# EAGLE design expLoRaBLE Thing Plus (EAGLE 9.6.2)

## Sheet 1 of 2
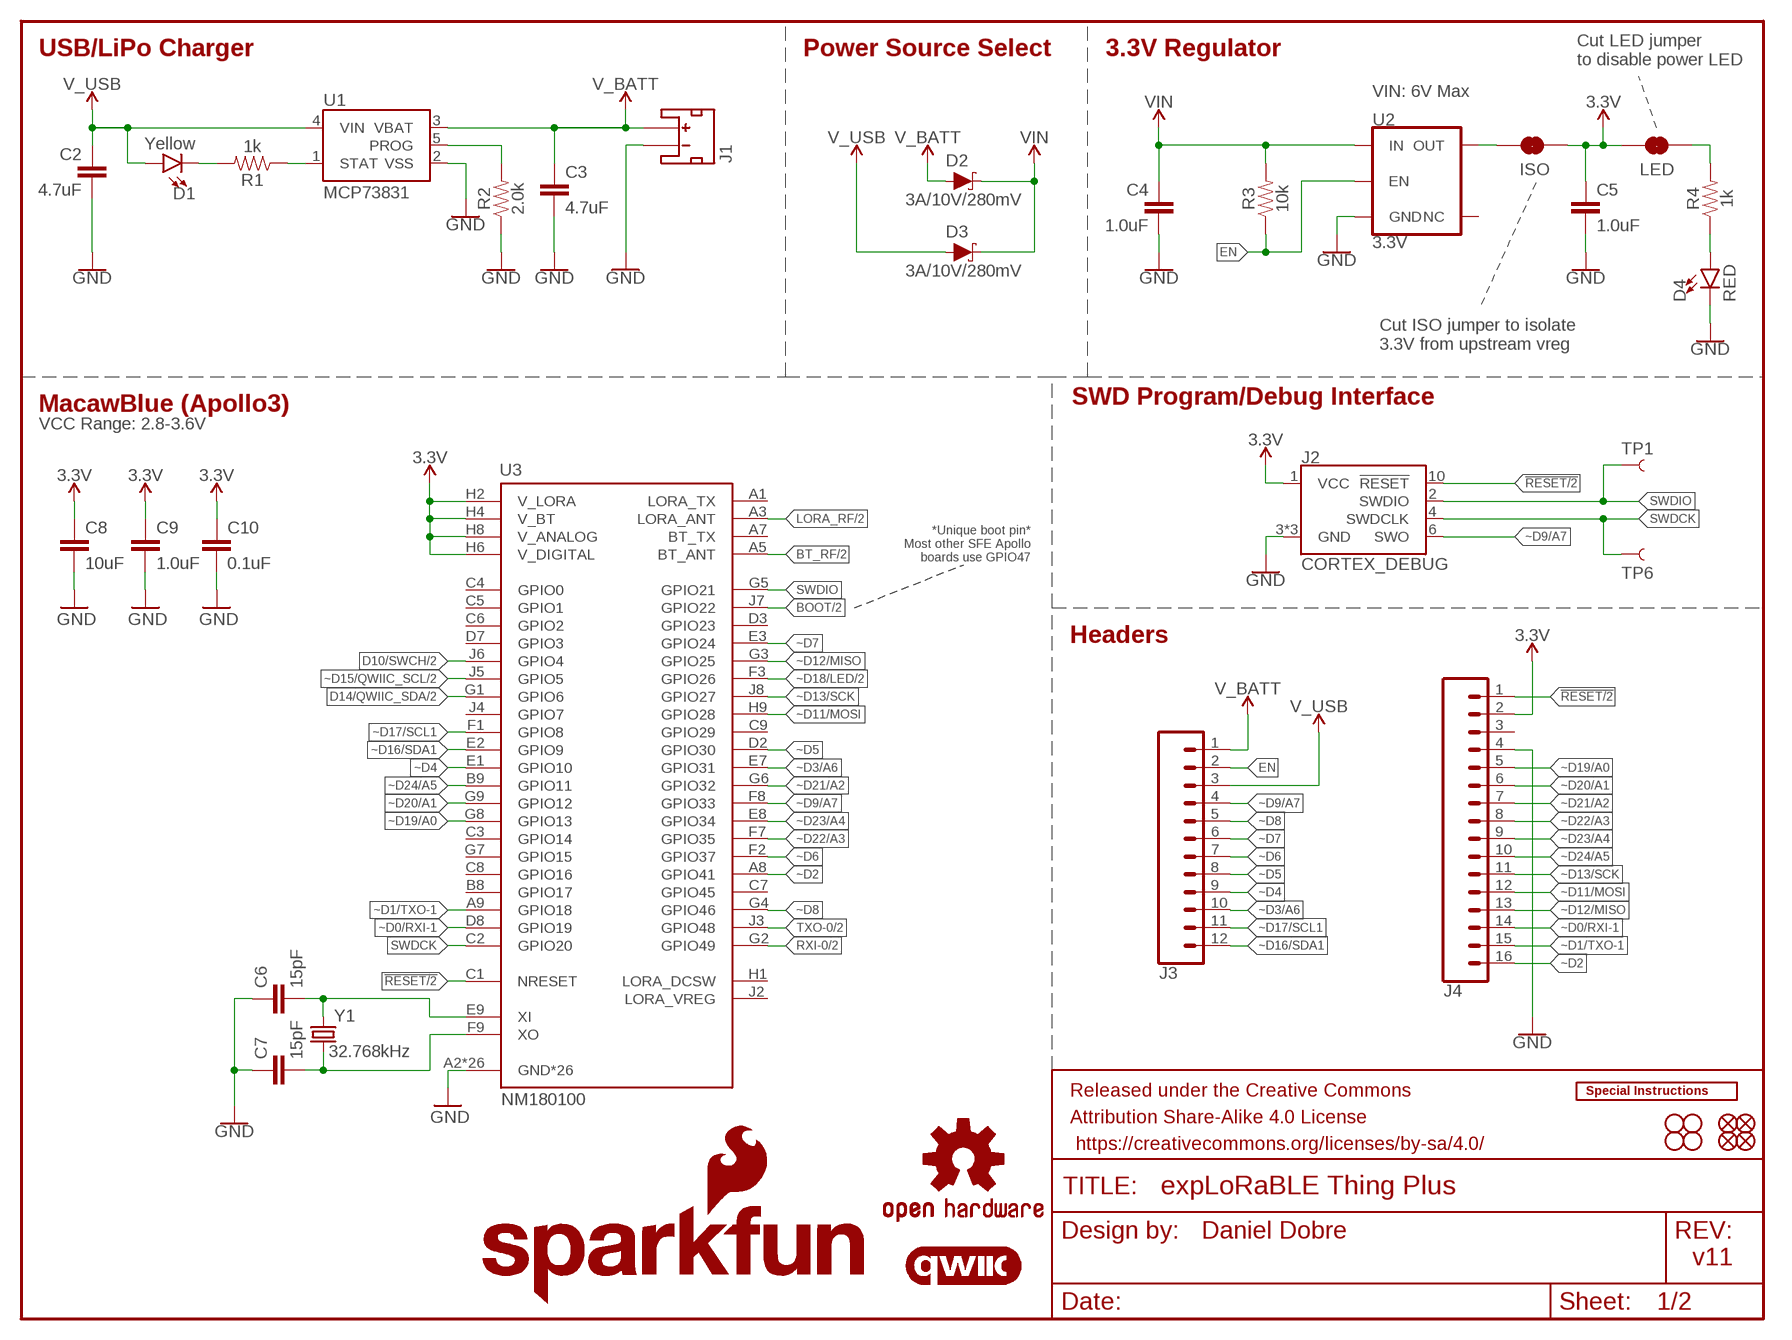
[diagram p0: schematic, sheet 1]

### Parts
C2  4.7uF  4.7UF-0603-6.3V-(10%)  [0603]
C3  4.7uF  4.7UF-0603-6.3V-(10%)  [0603]
C4  1.0uF  1.0UF-0603-16V-10%  [0603]
C5  1.0uF  1.0UF-0603-16V-10%  [0603]
C6  15pF  15PF-0603-50V-5%  [0603]
C7  15pF  15PF-0603-50V-5%  [0603]
C8  10uF  10UF-0603-6.3V-20%  [0603]
C9  1.0uF  1.0UF-0603-16V-10%  [0603]
C10  0.1uF  0.1UF-0603-25V-(+80/-20%)  [0603]
D1  Yellow  LED-YELLOW0603  [LED-0603]
D2  3A/10V/280mV  DIODE-SCHOTTKY-BAT60A  [SOD-323]
D3  3A/10V/280mV  DIODE-SCHOTTKY-BAT60A  [SOD-323]
D4  RED  LED-RED0603  [LED-0603]
FD1  FIDUCIALUFIDUCIAL  [FIDUCIAL-MICRO]
FD2  FIDUCIALUFIDUCIAL  [FIDUCIAL-MICRO]
FD3  FIDUCIALUFIDUCIAL  [FIDUCIAL-MICRO]
FD4  FIDUCIALUFIDUCIAL  [FIDUCIAL-MICRO]
FRAME1  FRAME-LETTER  [CREATIVE_COMMONS]
H1  STAND-OFF  [STAND-OFF]
H2  STAND-OFF  [STAND-OFF]
H3  STAND-OFF  [STAND-OFF]
H4  STAND-OFF  [STAND-OFF]
ISO  JUMPER-SMT_2_NC_TRACE_SILK  [SMT-JUMPER_2_NC_TRACE_SILK]
J1  JST_2MM_MALE  [JST-2-SMD]
J2  CORTEX_DEBUG  CORTEX_DEBUG_MINIMUM_PTH_NS  [2X5-PTH-1.27MM-NO_SILK]
J3  CONN_12SM_SQ_NO_SILK  [1X12_SM_SQ_NOSILK]
J4  CONN_161X16_SM_SQ_NOSILK  [1X16_SM_SQ_NOSILK]
LED  JUMPER-SMT_2_NC_TRACE_SILK  [SMT-JUMPER_2_NC_TRACE_SILK]
LOGO1  OSHW-LOGOS  [OSHW-LOGO-S]
LOGO2  QWIIC_LOGO_5MM  [QWIIC_5MM]
LOGO3  SFE_LOGO_NAME_FLAME.1_INCH  [SFE_LOGO_NAME_FLAME_.1]
LOGO4  SPECIAL_INSTRUCTIONS-ORDERING  [ORDERING_INSTRUCTIONS]
R1  1k  1KOHM-0603-1/10W-1%  [0603]
R2  2.0k  2.0KOHM-0603-1/10W-5%  [0603]
R3  10k  10KOHM-0603-1/10W-1%  [0603]
R4  1k  1KOHM-0603-1/10W-1%  [0603]
TP1  TEST-POINTTP_15TH_THRU  [TP_15TH]
TP6  TEST-POINTTP_15TH_THRU  [TP_15TH]
U1  MCP73831  [SOT23-5]
U2  3.3V  V_REG_AP2112K-3.3V  [SOT23-5]
U3  NM180100  [LGA81]
Y1  32.768kHz  CRYSTAL-32.768KHZSMD-3.2X1.5  [CRYSTAL-SMD-3.2X1.5MM]

### Nets
3.3V: C5.1 C8.1 C9.1 C10.1 ISO.1 J2.1(VCC) J4.2 LED.2 U3.H2(V_LORA) U3.H4(V_BT) U3.H6(V_DIGITAL) U3.H8(V_ANALOG) ; also sheet 2
!RESET: J2.10(!RESET) J4.1 U3.C1(NRESET) ; also sheet 2
BOOT: U3.J7(GPIO22) ; also sheet 2
BT_RF: U3.A5(BT_ANT) ; also sheet 2
D10/SWCH: U3.J6(GPIO4) ; also sheet 2
D14/QWIIC_SDA: U3.G1(GPIO6) ; also sheet 2
EN: J3.2 R3.1 U2.3(EN)
GND: C2.2 C3.2 C4.2 C5.2 C6.1 C7.1 C8.2 C9.2 C10.2 D4.C J1.1(-) J2.3(GND) J2.5(GND) J2.9(GND) J4.4 R2.1 U1.2(VSS) U2.2(GND) U3.A2(GND*26) U3.A4(GND*26) U3.A6(GND*26) U3.B1(GND*26) U3.B2(GND*26) U3.B3(GND*26) U3.B4(GND*26) U3.B5(GND*26) U3.B6(GND*26) U3.B7(GND*26) U3.D1(GND*26) U3.D4(GND*26) U3.D5(GND*26) U3.D6(GND*26) U3.D9(GND*26) U3.E4(GND*26) U3.E5(GND*26) U3.E6(GND*26) U3.F4(GND*26) U3.F5(GND*26) U3.F6(GND*26) U3.H3(GND*26) U3.H5(GND*26) U3.H7(GND*26) U3.J1(GND*26) U3.J9(GND*26) ; also sheet 2
LORA_RF: U3.A3(LORA_ANT) ; also sheet 2
N$1: R2.2 U1.5(PROG)
N$2: C7.2 U3.F9(XO) Y1.P$2
N$3: D1.C R1.2
N$4: R1.1 U1.1(STAT)
N$6: LED.1 R4.2
N$8: C6.2 U3.E9(XI) Y1.P$1
N$10: D4.A R4.1
N$14: ISO.2 U2.5(OUT)
RXI-0: U3.G2(GPIO49) ; also sheet 2
SWDCK: J2.4(SWDCLK) TP6.P$1 U3.C2(GPIO20)
SWDIO: J2.2(SWDIO) TP1.P$1 U3.G5(GPIO21)
TXO-0: U3.J3(GPIO48) ; also sheet 2
V_BATT [power]: C3.1 D2.A J1.2(+) J3.1 U1.3(VBAT)
V_USB: C2.1 D1.A D3.A J3.3 U1.4(VIN) ; also sheet 2
VIN: C4.1 D2.C D3.C R3.2 U2.1(IN)
~D0/RXI-1: J4.14 U3.D8(GPIO19)
~D1/TXO-1: J4.15 U3.A9(GPIO18)
~D2: J4.16 U3.A8(GPIO41)
~D3/A6: J3.10 U3.E7(GPIO31)
~D4: J3.9 U3.E1(GPIO10)
~D5: J3.8 U3.D2(GPIO30)
~D6: J3.7 U3.F2(GPIO37)
~D7: J3.6 U3.E3(GPIO24)
~D8: J3.5 U3.G4(GPIO46)
~D9/A7: J2.6(SWO) J3.4 U3.F8(GPIO33)
~D11/MOSI: J4.12 U3.H9(GPIO28)
~D12/MISO: J4.13 U3.G3(GPIO25)
~D13/SCK: J4.11 U3.J8(GPIO27)
~D15/QWIIC_SCL: U3.J5(GPIO5) ; also sheet 2
~D16/SDA1: J3.12 U3.E2(GPIO9)
~D17/SCL1: J3.11 U3.F1(GPIO8)
~D18/LED: U3.F3(GPIO26) ; also sheet 2
~D19/A0: J4.5 U3.G8(GPIO13)
~D20/A1: J4.6 U3.G9(GPIO12)
~D21/A2: J4.7 U3.G6(GPIO32)
~D22/A3: J4.8 U3.F7(GPIO35)
~D23/A4: J4.9 U3.E8(GPIO34)
~D24/A5: J4.10 U3.B9(GPIO11)
Unconnected: J1.NC1(PAD1) J1.NC2(PAD2) J4.3 U2.4(NC) U3.A1(LORA_TX) U3.A7(BT_TX) U3.B8(GPIO17) U3.C3(GPIO14) U3.C4(GPIO0) U3.C5(GPIO1) U3.C6(GPIO2) U3.C7(GPIO45) U3.C8(GPIO16) U3.C9(GPIO29) U3.D3(GPIO23) U3.D7(GPIO3) U3.G7(GPIO15) U3.H1(LORA_DCSW) U3.J2(LORA_VREG) U3.J4(GPIO7)

### Notes on the sheet
- USB/LiPo Charger | Power Source Select | 3.3V Regulator
- Cut LED jumper
  to disable power LED
- VIN: 6V Max
- Cut ISO jumper to isolate 
  3.3V from upstream vreg
- SWD Program/Debug Interface
- MacawBlue (Apollo3)
- VCC Range: 2.8-3.6V
- *Unique boot pin*
  Most other SFE Apollo
  boards use GPIO47
- Headers
- Daniel Dobre
- v11

## Sheet 2 of 2
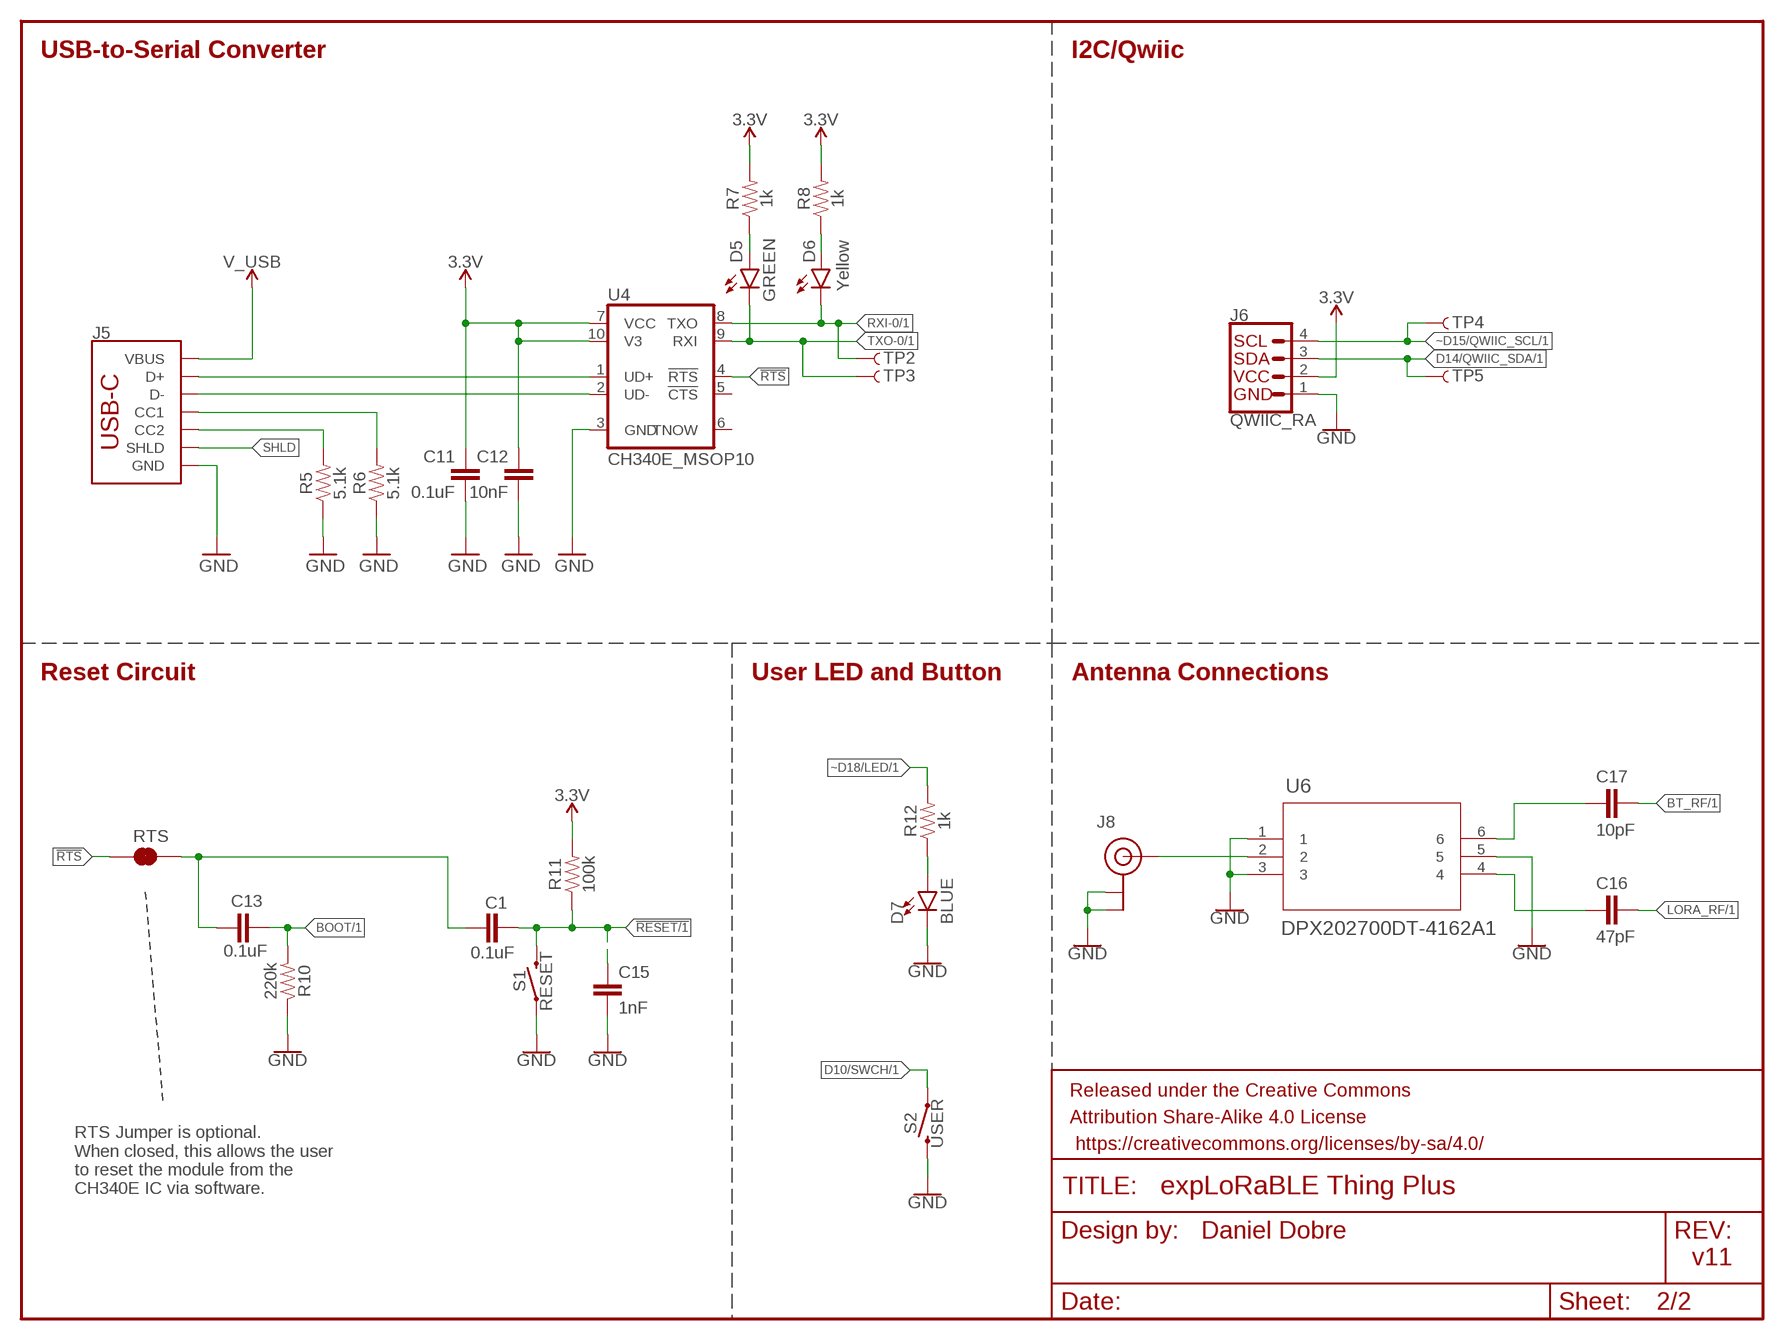
[diagram p1: schematic, sheet 2]

### Parts
C1  0.1uF  0.1UF-0603-25V-(+80/-20%)  [0603]
C11  0.1uF  0.1UF-0603-25V-(+80/-20%)  [0603]
C12  10nF  10NF-0603-50V-10%  [0603]
C13  0.1uF  0.1UF-0603-25V-(+80/-20%)  [0603]
C15  1nF  1.0NF/1000PF-0603-50V-10%  [0603]
C16  47pF  47PF-0603-50V-5%  [0603]
C17  10pF  10PF-0603-50V-5%  [0603]
D5  GREEN  LED-GREEN0603  [LED-0603]
D6  Yellow  LED-YELLOW0603  [LED-0603]
D7  BLUE  LED-BLUE0603  [LED-0603]
FRAME2  FRAME-LETTERNO_PACKAGE  [DUMMY]
J5  USB Female Type C Connector  USB_C_4-LAYER-ISOLATED  [USB-C-16P-4LAYER-ISOLATED]
J6  QWIIC_RA  QWIIC_CONNECTORJS-1MM  [JST04_1MM_RA]
J8  U.FL  [U.FL]
R5  5.1k  5.1KOHM5.1KOHM-0603-1/10W-1%  [0603]
R6  5.1k  5.1KOHM5.1KOHM-0603-1/10W-1%  [0603]
R7  1k  1KOHM-0603-1/10W-1%  [0603]
R8  1k  1KOHM-0603-1/10W-1%  [0603]
R10  220k  220KOHM-0603-1/10W-1%  [0603]
R11  100k  100KOHM-0603-1/10W-1%  [0603]
R12  1k  1KOHM-0603-1/10W-1%  [0603]
RTS  JUMPER-SMT_2_NC_TRACE_SILK  [SMT-JUMPER_2_NC_TRACE_SILK]
S1  RESET  MOMENTARY-SWITCH-SPST-SMD-4.6X2.8MM  [TACTILE_SWITCH_SMD_4.6X2.8MM]
S2  USER  MOMENTARY-SWITCH-SPST-SMD-4.6X2.8MM  [TACTILE_SWITCH_SMD_4.6X2.8MM]
TP2  TEST-POINTTP_15TH_THRU  [TP_15TH]
TP3  TEST-POINTTP_15TH_THRU  [TP_15TH]
TP4  TEST-POINTTP_15TH_THRU  [TP_15TH]
TP5  TEST-POINTTP_15TH_THRU  [TP_15TH]
U4  CH340E_MSOP10  [MSOP10]
U6  DPX202700DT-4162A1  [RF_4060A1_TDK]

### Nets
3.3V: C11.1 C12.1 J6.2 R7.2 R8.2 R11.2 U4.7(VCC) U4.10(V3) ; also sheet 1
!RESET: C1.2 C15.1 R11.1 S1.3 S1.4 ; also sheet 1
!RTS: RTS.1 U4.4(!RTS)
BOOT: C13.2 R10.2 ; also sheet 1
BT_RF: C17.1 ; also sheet 1
CC1: J5.A5(CC1) R6.2
CC2: J5.B5(CC2) R5.2
D10/SWCH: S2.1 S2.2 ; also sheet 1
D14/QWIIC_SDA: J6.3 TP5.P$1 ; also sheet 1
D+1: J5.A6(D+) J5.B6(D+) U4.1(UD+)
D-1: J5.A7(D-) J5.B7(D-) U4.2(UD-)
GND: C11.2 C12.2 C15.2 D7.C J5.GND J5.GND2(GND) J6.1 J8.1(GND) J8.2(GND) R5.1 R6.1 R10.1 S1.1 S1.2 S2.3 S2.4 U4.3(GND) U6.1 U6.3 U6.5 ; also sheet 1
LORA_RF: C16.1 ; also sheet 1
N$5: D5.A R7.1
N$7: D7.A R12.1
N$9: D6.A R8.1
N$11: C17.2 U6.6
N$12: J8.FEED(SIGNAL) U6.2
N$13: C16.2 U6.4
N$15: C1.1 C13.1 RTS.2
RXI-0: D6.C TP2.P$1 U4.8(TXO) ; also sheet 1
SHLD: J5.SHLD1(SHLD) J5.SHLD2(SHLD) J5.SHLD3(SHLD) J5.SHLD4(SHLD) J5.SHLD5(SHLD) J5.SHLD6(SHLD) J5.SHLD7(SHLD) J5.SHLD8(SHLD)
TXO-0: D5.C TP3.P$1 U4.9(RXI) ; also sheet 1
V_USB: J5.VBUS1(VBUS) J5.VBUS2(VBUS) ; also sheet 1
~D15/QWIIC_SCL: J6.4 TP4.P$1 ; also sheet 1
~D18/LED: R12.2 ; also sheet 1
Unconnected: U4.5(!CTS) U4.6(TNOW)

### Notes on the sheet
- USB-to-Serial Converter | I2C/Qwiic
- Reset Circuit | User LED and Button | Antenna Connections
- RTS Jumper is optional.
  When closed, this allows the user 
  to reset the module from the 
  CH340E IC via software.
- Daniel Dobre
- v11

## Library data of the parts
C1 C10 C11 C13 = SparkFun-Capacitors:0.1UF: 0.1µF ceramic capacitors A capacitor is a passive two-terminal electrical component used to store electrical energy temporarily in an electric field.; PROD_ID: CAP-00810
C2 C3 = SparkFun-Capacitors:4.7UF: 4.7µF ceramic capacitors A capacitor is a passive two-terminal electrical component used to store electrical energy temporarily in an electric field.; PROD_ID: CAP-08280
C4 C5 C9 = SparkFun-Capacitors:1.0UF: 1µF ceramic capacitors A capacitor is a passive two-terminal electrical component used to store electrical energy temporarily in an electric field.; PROD_ID: CAP-00868
C6 C7 = SparkFun-Capacitors:15PF: 15pF ceramic capacitors A capacitor is a passive two-terminal electrical component used to store electrical energy temporarily in an electric field.; PROD_ID: CAP-07881
C8 = SparkFun-Capacitors:10UF: 10.0µF ceramic capacitors A capacitor is a passive two-terminal electrical component used to store electrical energy temporarily in an electric field.; PROD_ID: CAP-11015
C12 = SparkFun-Capacitors:10NF: 0.01uF/10nF/10,000pF ceramic capacitors A capacitor is a passive two-terminal electrical component used to store electrical energy temporarily in an electric field. CAP-09321; PROD_ID: CAP-00867
C15 = SparkFun-Capacitors:1.0NF/1000PF: 1nF/1,000pF ceramic capacitors A capacitor is a passive two-terminal electrical component used to store electrical energy temporarily in an electric field.; PROD_ID: CAP-07886
C16 = SparkFun-Capacitors:47PF: 47pF ceramic capacitors A capacitor is a passive two-terminal electrical component used to store electrical energy temporarily in an electric field.; PROD_ID: CAP-08913
C17 = SparkFun-Capacitors:10PF: 10pF ceramic capacitors A capacitor is a passive two-terminal electrical component used to store electrical energy temporarily in an electric field.; PROD_ID: CAP-11812
D1 D6 = SparkFun-LED:LED-YELLOW: Yellow SMD LED Used in manufacturing several products at SparkFun. Packages: 0603 - SMD 0603 package[Product Link] <http://www.kingbrightusa.com/product.asp?catalog_name=LED&product_id=APT1608SYCK> 0603 -SMART - SMART SMD 0603 package (more efficient/more expensive) [Product Link] <http://www.osram-os.com/osram_os/en/products/product-catalog/led-light-emitting-diodes/smartled-0603/ly-l29k/index.jsp> LilyPad - SMD1206 package[Product Datasheet] <https://www.sparkfun.com/datasheets/DevTools/LilyPad/Q150YUS4.pdf> SparkFun Products: Blynk Board <https://www.sparkfun.com/products/13794> IOIO-OTG <https://www.sparkfun.com/products/13613> XBee Explorer Serial <https://www.sparkfun.com/products/13225>; PROD_ID: DIO-09003
D2 D3 = SparkFun-DiscreteSemi:DIODE-SCHOTTKY: Schottky diode A Schottky diode is a semiconductor diode which has a low forward voltage drop and a very fast switching action.; PROD_ID: DIO-14072
D4 = SparkFun-LED:LED-RED: Red SMD LED Used in manufacturing of most products at SparkFun Packages: 0603 - SMD 0603 package [Product Link] <http://docs.avagotech.com/docs/AV02-0551EN> 0603 SMART - SMD 0603 SMART package ( more efficient and expensive)[Product Link] <http://www.osram-os.com/Graphics/XPic2/00077099_0.pdf> 1206 - SMD1206 package [Product Link] <https://www.sparkfun.com/datasheets/DevTools/LilyPad/Q150OVS4.pdff> SparkFun Products: Pro Mini 328 -5V <https://www.sparkfun.com/products/821> RedBoard <https://www.sparkfun.com/products/12757> IOIO-OTG <https://www.sparkfun.com/products/13613>; PROD_ID: DIO-00819
D5 = SparkFun-LED:LED-GREEN: Green SMD LED Used in manufacturing of various products at SparkFun Packages: 0603 - SMD 0603 package [Product Link] <http://www.futureelectronics.com/en/technologies/semiconductors/optoelectronics/leds/Pages/9894312-LTST-C190GKT.aspx?CrossPart=HSMG-C190&IM=0> LilyPad 1206 - SMD1206 LilyPad package [Product Link] <http://www.futureelectronics.com/en/Technologies/Product.aspx?ProductID=IN150NGHARVATEKCORPORATION2049943&IM=0> 1206 - SMD1206 package [Product Link] <http://www.futureelectronics.com/en/technologies/semiconductors/optoelectronics/leds/Pages/8315665-LTST-C150KGKT.aspx?IM=0> 1206 Bottom Mount -SMD 1206 Bottom Mount [Product Link] <http://www.digikey.com/product-detail/en/lite-on-inc/LTST-C230KGKT/160-1456-1-ND/386854> SparkFun Products: Pro Mini 328 -5V <https://www.sparkfun.com/products/821> RedBoard <https://www.sparkfun.com/products/12757> MP3 Trigger <https://www.sparkfun.com/products/13720> Makey Makey <https://www.sparkfun.com/products/11076>; PROD_ID: DIO-00821
D7 = SparkFun-LED:LED-BLUE: Blue SMD LED Used in manufacturing of various products at SparkFun Packages: 0603 - SMD 0603 package [Product Link] <http://www.digikey.com/product-detail/en/SMLE12BC7TT86/511-1589-2-ND/1641808> 1206 - SMD1206 package [Product Link] <http://www.digikey.com/product-detail/en/lite-on-inc/LTST-C150TBKT/160-1643-1-ND/573584> SparkFun Products: ESP8266 Thing-Dev Board <https://www.sparkfun.com/products/13711> RedBoard <https://www.sparkfun.com/products/12757>; PROD_ID: DIO-08575
FD1-FD4 = SparkFun-Aesthetics:FIDUCIAL: Fiducial Alignment Points Point-of-reference for pick-and-place machines and other optical instruments.
FRAME1 = SparkFun-Aesthetics:FRAME-LETTER: Schematic Frame - Letter Standard 8.5x11 US Letter frame
FRAME2 = SparkFun-Aesthetics:FRAME-LETTER: Schematic Frame - Letter Standard 8.5x11 US Letter frame; DESIGNER: Nobody; VERSION: v01
H1-H4 = SparkFun-Hardware:STAND-OFF: Stand Off Drill holes for mechanically mounting via screws, standoffs, etc. Note: Use the keepout ring to avoid running the screw head into surrounding components. Variant Overviews STAND-OFF - Mechanical footprint for a #4 phillips button head screw. STAND-OFF-TIGHT - Mechanical footprint for a #4 phillips button head screw, Example SparkFun Products Screw - Phillips Head (1/4", 4-40, 10 pack) <https://www.sparkfun.com/products/10453> (PRT-10453) Screw - Phillips Head (1/2", 4-40, 10 pack) <https://www.sparkfun.com/products/10452> (PRT-10452) Screw - Phillips Head (3/4", 4-40, 10 pack) <https://www.sparkfun.com/products/10451> (PRT-10451) Screw - Phillips Head (1", 4-40, 10 pack) <https://www.sparkfun.com/products/10450> (PRT-10450)
ISO LED RTS = SparkFun-Jumpers:JUMPER-SMT_2_NC_TRACE: Normally closed trace jumper This jumper has a trace between two pads so it's normally closed (NC). Use a razor knife to open the connection. For best results follow the IPC guidelines for cutting traces: Cutout at least 0.063 mm (0.005 in). Remove all loose material to clean up the cut area. Seal the cut with an approved epoxy. Reapply solder to reclose the connection.
J1 = SparkFun-Connectors:JST_2MM_MALE: JST 2MM MALE RA CONNECTOR Two pin, compact surface mount connector. Commonly used as a battery input connection point. We really like the solid locking feeling and high current rating on these small connectors. We use these all the time as battery connectors. Mates to single-cell LiPo batteries. Here is the connector we sell at SparkFun: JST Right Angle Connector - White <https://www.sparkfun.com/products/8612> (PRT-08612) Datasheet <http://www.sparkfun.com/datasheets/Prototyping/Connectors/JST-Horizontal.pdf> It was used on these SparkFun products: SparkFun MOSFET Power Controller <https://www.sparkfun.com/products/11214> (PRT-11214) SparkFun Battery Babysitter - LiPo Battery Manager <https://www.sparkfun.com/products/13777> (PRT-13777) And many, many others that required a lipo battery connection.; PROD_ID: CONN-11443; SF_ID: PRT-08612
J2 = SparkFun-Connectors:CORTEX_DEBUG_MINIMUM: Cortex Debug Connector - 10 pin Supports JTAG debug, Serial Wire debug, and Serial Wire Viewer. PTH and SMD connector options available. General Connector Information <http://infocenter.arm.com/help/topic/com.arm.doc.faqs/attached/13634/cortex_debug_connectors.pdf> Products: PTH Connector <http://www.digikey.com/product-detail/en/cnc-tech/3220-10-0100-00/1175-1627-ND/3883661> -via Digi-Key SparkFun PSoc <https://www.sparkfun.com/products/13229> SparkFun T <https://www.sparkfun.com/products/13810>
J3 = SparkFun-Connectors:CONN_12: Multi connection point. Often used as Generic Header-pin footprint for 0.1 inch spaced/style header connections On any of the 0.1 inch spaced packages, you can populate with these: Break Away Headers - Straight <https://www.sparkfun.com/products/116> (PRT-00116) Break Away Male Headers - Right Angle <https://www.sparkfun.com/products/553> (PRT-00553) Female Headers <https://www.sparkfun.com/products/115> (PRT-00115) Break Away Headers - Machine Pin <https://www.sparkfun.com/products/117> (PRT-00117) Break Away Female Headers - Swiss Machine Pin <https://www.sparkfun.com/products/743> (PRT-00743) For SCREWTERMINALS and SPRING TERMINALS visit here: Screw Terimnals on SparkFun.com <https://www.sparkfun.com/search/results?term=Screw+Terminals> (5mm/3.5mm/2.54mm spacing) This device is also useful as a general connection point to wire up your design to another part of your project. Our various solder wires solder well into these plated through hole pads. Hook-Up Wire - Assortment (Stranded, 22 AWG) <https://www.sparkfun.com/products/11375> (PRT-11375) Hook-Up Wire - Assortment (Solid Core, 22 AWG) <https://www.sparkfun.com/products/11367> (PRT-11367) View the entire wire category on our website here <https://www.sparkfun.com/categories/141> Special notes: Molex polarized connector foot print use with SKU : PRT-08231 with associated crimp pins and housings. 1MM SMD Version SKU: PRT-10208 NOTES ON THE VARIANTS LOCK and LOCK_LONGPADS... This footprint was designed to help hold the alignment of a through-hole component (i.e. 6-pin header) while soldering it into place. You may notice that each hole has been shifted either up or down by 0.005 of an inch from it's more standard position (which is a perfectly straight line). This slight alteration caused the pins (the squares in the middle) to touch the edges of the holes. Because they are alternating, it causes a "brace" to hold the component in place. 0.005 has proven to be the perfect amount of "off-center" position when using our standard breakaway headers. Although looks a little odd when you look at the bare footprint, once you have a header in there, the alteration is very hard to notice. Also,if you push a header all the way into place, it is covered up entirely on the bottom side.
J4 = SparkFun-Connectors:CONN_16: Multi connection point. Often used as Generic Header-pin footprint for 0.1 inch spaced/style header connections On any of the 0.1 inch spaced packages, you can populate with these: Break Away Headers - Straight <https://www.sparkfun.com/products/116> (PRT-00116) Break Away Male Headers - Right Angle <https://www.sparkfun.com/products/553> (PRT-00553) Female Headers <https://www.sparkfun.com/products/115> (PRT-00115) Break Away Headers - Machine Pin <https://www.sparkfun.com/products/117> (PRT-00117) Break Away Female Headers - Swiss Machine Pin <https://www.sparkfun.com/products/743> (PRT-00743) For SCREWTERMINALS and SPRING TERMINALS visit here: Screw Terimnals on SparkFun.com <https://www.sparkfun.com/search/results?term=Screw+Terminals> (5mm/3.5mm/2.54mm spacing) This device is also useful as a general connection point to wire up your design to another part of your project. Our various solder wires solder well into these plated through hole pads. Hook-Up Wire - Assortment (Stranded, 22 AWG) <https://www.sparkfun.com/products/11375> (PRT-11375) Hook-Up Wire - Assortment (Solid Core, 22 AWG) <https://www.sparkfun.com/products/11367> (PRT-11367) View the entire wire category on our website here <https://www.sparkfun.com/categories/141> Special notes: Molex polarized connector foot print use with SKU : PRT-08231 with associated crimp pins and housings. 1MM SMD Version SKU: PRT-10208 NOTES ON THE VARIANTS LOCK and LOCK_LONGPADS... This footprint was designed to help hold the alignment of a through-hole component (i.e. 6-pin header) while soldering it into place. You may notice that each hole has been shifted either up or down by 0.005 of an inch from it's more standard position (which is a perfectly straight line). This slight alteration caused the pins (the squares in the middle) to touch the edges of the holes. Because they are alternating, it causes a "brace" to hold the component in place. 0.005 has proven to be the perfect amount of "off-center" position when using our standard breakaway headers. Although looks a little odd when you look at the bare footprint, once you have a header in there, the alteration is very hard to notice. Also,if you push a header all the way into place, it is covered up entirely on the bottom side.
J5 = SparkFun-Connectors:USB_C: USB Type C 16Pin Connector Super Speed pins not available on the 16-pin purely SMD connector so this part is best for USB 2.0 implementations. D1 and D2 are tied together enabling D+/- no matter which way the cable is plugged into the connector. The two channel configuration pins (CC1/2) are exposed. These are normally connected to ground via 5.1k resistors but can be reconfigured for high current/high power applications. **4-LAYER BOARD WARNING!!** If designing 4-layer board, make sure to select the variant _4-LAYER-ISOLATED. The linked footprint (USB-C-16-4LAYER-ISOLATED) includes some very necessary cutout polygons in the inner layers (2 and 15). This prevents the PTH mounting shield legs on the USB connector from electrically connecting any other polygons on the inner layers (usually VCC and GND).; PROD_ID: CONN-14122
J6 = SparkFun-Connectors:QWIIC_CONNECTOR: SparkFun I2C Standard Qwiic Connector An SMD 1mm pitch JST connector makes it easy and quick (get it? Qwiic?) to connect I2C devices to each other. The Qwiic system <http://www.sparkfun.com/qwiic> enables fast and solderless connection between popular platforms and various sensors and actuators. We carry 200mm <https://www.sparkfun.com/products/14204>, 100mm <https://www.sparkfun.com/products/14205>, 50mm <https://www.sparkfun.com/products/14206>, and breadboard friendly <https://www.sparkfun.com/products/14207> Qwiic cables. We also offer 10 pcs strips <https://www.sparkfun.com/products/14323> the SMD connectors.; PROD_ID: CONN-13694; VALUE: QWIIC_RIGHT_ANGLE
J8 = SparkFun-Connectors:U.FL: SMD Antenna Connector - U.FL 2mm height, 3.0mm x 3.0mm receptacle size. SparkFun Products: SparkFun WiFi Shield - ESP8266 <https://www.sparkfun.com/products/13287> SparkFun ESP8266 Thing <https://www.sparkfun.com/products/13231> SparkFun MiniGen - Pro Mini Signal Generator Shield <https://www.sparkfun.com/products/11420>; PROD_ID: CONN-09193; SF_ID: WRL-09144
LOGO1 = SparkFun-Aesthetics:OSHW-LOGO: Open-Source Hardware (OSHW) Logo This logo indicates the piece of hardware it is found on incorporates a OSHW license and/or adheres to the definition of open source hardware found here: http://freedomdefined.org/OSHW
LOGO2 = SparkFun-Aesthetics:QWIIC_LOGO: Qwiic Logos for placement on schematic and PCB. The 5.5mm silk logo is best for placing next to Qwiic connector.
LOGO3 = SparkFun-Aesthetics:SFE_LOGO_NAME_FLAME: SparkFun Font Logo w/ Flame This is the SparkFun full logo. The logo on the schematic will always be the same size; the package variant is the height of the flame part of the logo. Default layer for the logo on the board is tSilk.
LOGO4 = SparkFun-Aesthetics:SPECIAL_INSTRUCTIONS: Special Ordering/Production Instructions Alert Symbol for special PCB ordering instructions or unique production process warnings. Ordering Instructions Production Instructions Types of information that should be added to box: Copper weight Soldermask color Silk color PCB thickness Number of layers PCB Standard: 1.6mm FR4 1 oz copper immersion silver plating red soldermask white silkscreen Types of information that should be added to box: Special wash requirements Depaneling instructions Humidification Glue curing Default text settings: 0.07 inch 9% ratio 50% line distance
R1 R4 R7 R8 R12 = SparkFun-Resistors:1KOHM: 1kΩ resistor A resistor is a passive two-terminal electrical component that implements electrical resistance as a circuit element. Resistors act to reduce current flow, and, at the same time, act to lower voltage levels within circuits. - Wikipedia; PROD_ID: RES-07856
R2 = SparkFun-Resistors:2.0KOHM: 2kΩ resistor A resistor is a passive two-terminal electrical component that implements electrical resistance as a circuit element. Resistors act to reduce current flow, and, at the same time, act to lower voltage levels within circuits. - Wikipedia; PROD_ID: RES-08296
R3 = SparkFun-Resistors:10KOHM: 10kΩ resistor A resistor is a passive two-terminal electrical component that implements electrical resistance as a circuit element. Resistors act to reduce current flow, and, at the same time, act to lower voltage levels within circuits. - Wikipedia; PROD_ID: RES-00824
R5 R6 = SparkFun-Resistors:5.1KOHM; PROD_ID: RES-12083
R10 = SparkFun-Resistors:220KOHM: 220kΩ resistor A resistor is a passive two-terminal electrical component that implements electrical resistance as a circuit element. Resistors act to reduce current flow, and, at the same time, act to lower voltage levels within circuits. - Wikipedia; PROD_ID: RES-08969
R11 = SparkFun-Resistors:100KOHM: 100kΩ resistor A resistor is a passive two-terminal electrical component that implements electrical resistance as a circuit element. Resistors act to reduce current flow, and, at the same time, act to lower voltage levels within circuits. - Wikipedia; PROD_ID: RES-07828
S1 S2 = SparkFun-Switches:MOMENTARY-SWITCH-SPST: Momentary Switch (Pushbutton) - SPST Normally-open (NO) SPST momentary switches (buttons, pushbuttons). Variants PTH-12MM - 12mm square, through-hole Momentary Pushbutton Switch - 12mm Square <https://www.sparkfun.com/products/9190> (COM-09190) PTH-6.0MM, PTH-6.0MM-KIT - 6.0mm square, through-hole Mini Pushbutton Switch <https://www.sparkfun.com/products/97> (COM-00097) KIT package intended for soldering kit's - only one side of pads' copper is exposed. PTH-RIGHT-ANGLE-KIT - Right-angle, through-hole Right Angle Tactile Button <https://www.sparkfun.com/products/10791> - Used on SparkFun BigTime Watch Kit <https://www.sparkfun.com/products/11734> SMD-12MM - 12mm square, surface-mount Tactile Button - SMD (12mm) <https://www.sparkfun.com/products/12993> (COM-12993) Used on SparkFun PicoBoard <https://www.sparkfun.com/products/11888> SMD-4.5MM - 4.5mm Square Trackball Switch Used on SparkFun Blackberry Trackballer Breakout <https://www.sparkfun.com/products/13169> SMD-4.6MMX2.8MM - 4.60mm x 2.80mm, surface mount Used on SparkFun SAMD21 Mini Breakout <https://www.sparkfun.com/products/13664> SMD-5.2MM, SMD-5.2-REDUNDANT - 5.2mm square, surface-mount Mini Pushbutton Switch - SMD <https://www.sparkfun.com/products/8720> (COM-08720) Used on Arduino Pro Mini <https://www.sparkfun.com/products/11114> REDUNDANT package connects both switch circuits together SMD-6.0X3.5MM - 6.0 x 3.5mm, surface mount Momentary Reset Switch SMD <https://www.sparkfun.com/products/8229> (COM-08229) SMD-6.2MM-TALL - 6.2mm square, surface mount Tactile Button - SMD (6mm) <https://www.sparkfun.com/products/12992> Used on SparkFun Digital Sandbox <https://www.sparkfun.com/products/12651> SMD-RIGHT-ANGLE - Right-angle, surface mount Used on SparkFun Block for Intel® Edison - Arduino <https://www.sparkfun.com/products/13036>; PROD_ID: SWCH-13065
TP1-TP6 = SparkFun-Connectors:TEST-POINT: SparkFun Test Points Bare copper test points for troubleshooting or In-Circuit-Testing. These are used by our Production team for verifying production board runs using pogo-pins on test beds. SparkFun Products: SparkFun LSM9DS1 Breakout <https://www.sparkfun.com/products/13284> SparkFun PSOC <https://www.sparkfun.com/products/13714> SparkFun Load Cell Amplifier <https://www.sparkfun.com/products/13879>
U1 = SparkFun-IC-Power:MCP73831: MCP73831T Li-Ion, Li-Pol Controller Miniature single cell, fully integrated Li-Ion, Li-polymer charge management controller Datasheet <http://ww1.microchip.com/downloads/en/DeviceDoc/20001984g.pdf> SparkFun Products: SparkFun ESP32 Thing <https://www.sparkfun.com/products/13907> SparkFun 9DoF Razor IMU M0 <https://www.sparkfun.com/products/14001>; PROD_ID: IC-09995
U2 = SparkFun-IC-Power:V_REG_AP2112: AP2112 - 600mA CMOS LDO Regulator w/ Enable The AP2112 is CMOS process low dropout linear regulator with enable function, the regulator delivers a guaranteed 600mA (min.) continuous load current. Features Output Voltage Accuracy: ±1.5% Output Current: 600mA (Min.) Foldback Short Current Protection: 50mA Enable Function to Turn ON/OFF VOUT Low Dropout Voltage (3.3V): 250mV (Typ.) @IOUT=600mA Excellent Load Regulation: 0.2%/A (Typ.) Excellent Line Regulation: 0.02%/V (Typ.) Low Quiescent Current: 55μA (Typ.) Low Standby Current: 0.01μA (Typ.) Low Output Noise: 50μVRMS PSRR: 100Hz -65dB, 1kHz -65dB OTSD Protection Stable with 1.0μF Flexible Cap: Ceramic, Tantalum and Aluminum Electrolytic Operation Temperature Range: -40°C to 85°C ESD: MM 400V, HBM 4000V; PROD_ID: VREG-12457
U3 = JTD_Consulting:NM180100; PROD_ID: IC-15464
U4 = SparkFun-IC-Comms:CH340E; PROD_ID: IC-14135
U6 = DPX202700DT:DPX202700DT-4162A1; BUILT_BY: EMA_Matt; COPYRIGHT: Copyright (C) 2018 Accelerated Designs. All rights reserved; MANUFACTURER_PART_NUMBER: DPX202700DT-4162A1; PROD_ID: IC-15465; SOURCELIBRARY: TDK_2019-10-09; VENDOR: TDK
Y1 = SparkFun-Clocks:CRYSTAL-32.768KHZ: 32.768kHz Crystal Frequency: 32.768kHz Frequency Stability: ±20ppm Load Capacitance: 12.5pF (PTH-2X6 & SMD-3.2X1.5), 6pF (SMD-2X6) SparkFun Products: SparkFun BigTime Watch Kit <https://www.sparkfun.com/products/11734> SparkFun nRF52832 Breakout <https://www.sparkfun.com/products/13990> SparkFun Real Time Clock Module <https://www.sparkfun.com/products/12708>; PROD_ID: XTAL-13062

## Net classes
1 power: width 0.762 mm

## Board
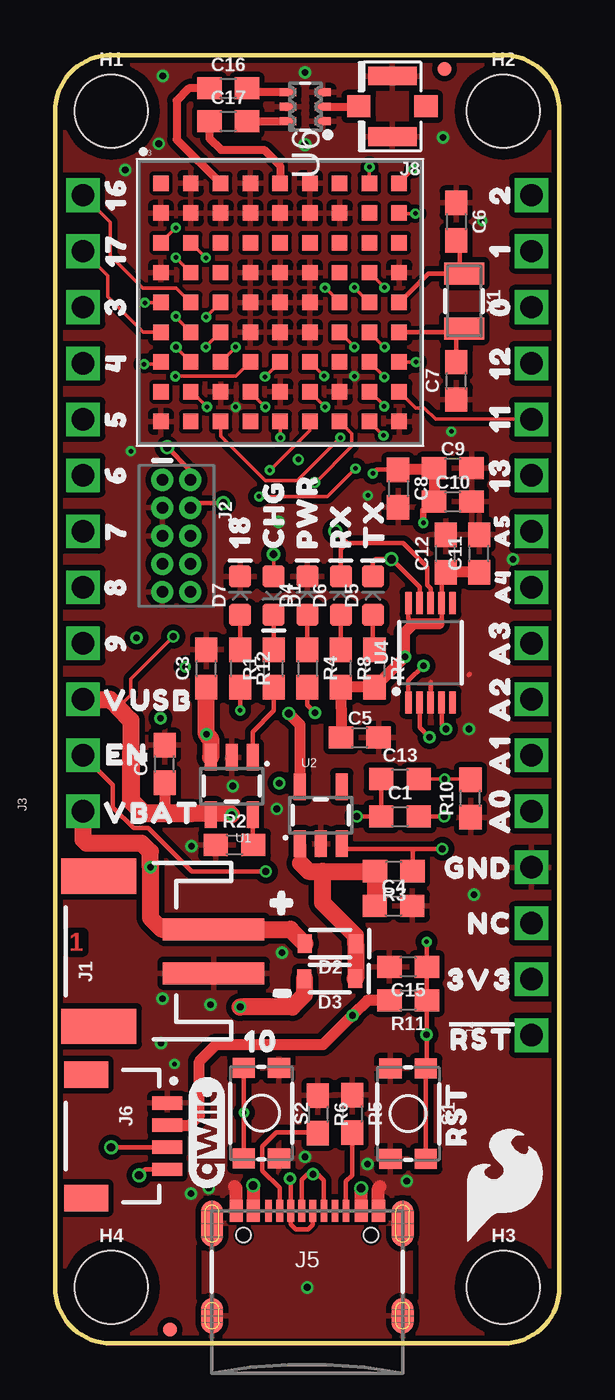
[diagram p2: board, top side]
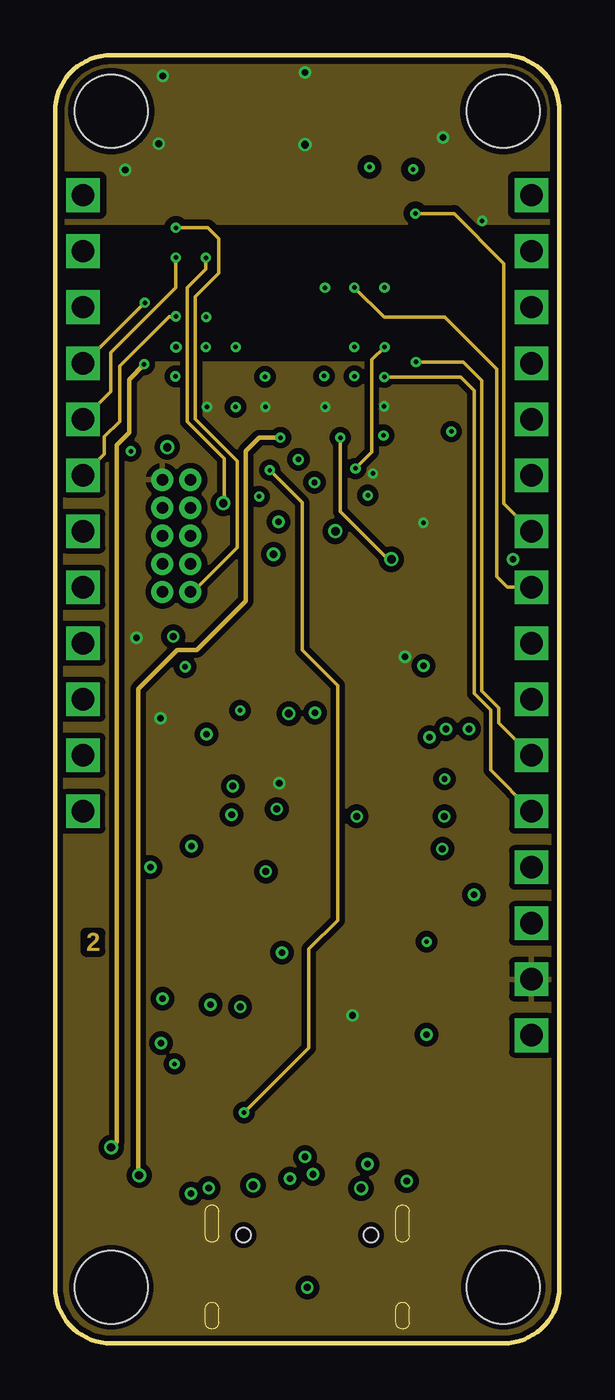
[diagram p3: board, inner layer Route2]
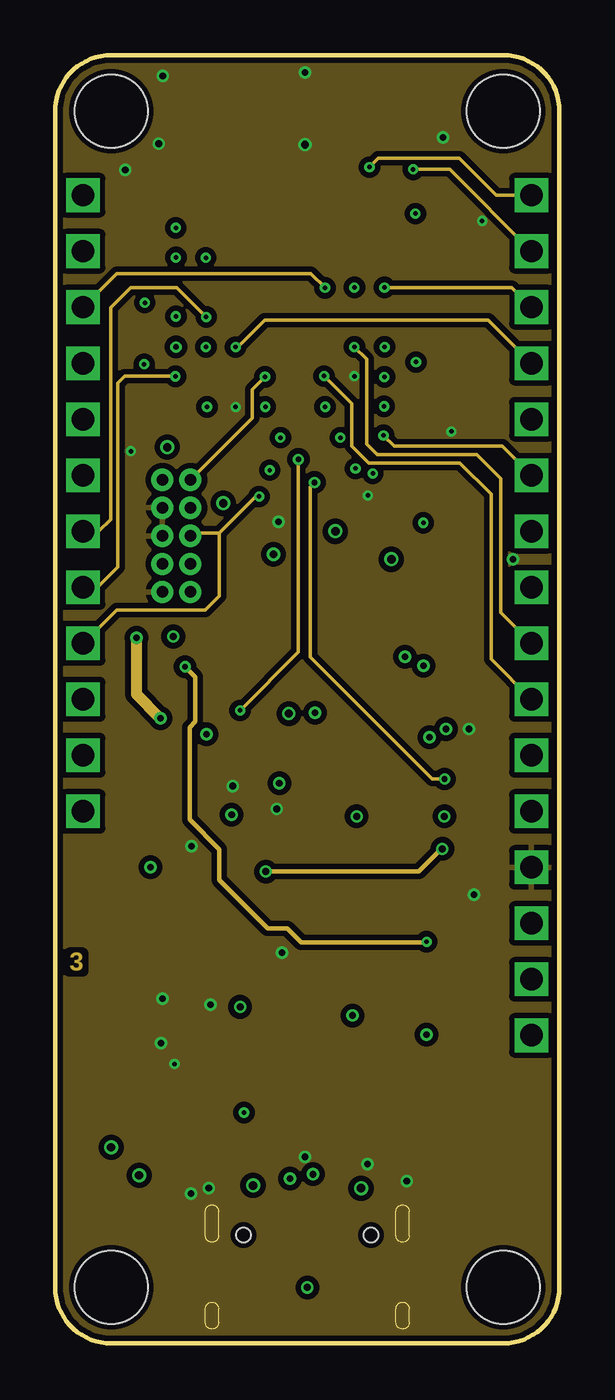
[diagram p4: board, inner layer Route15]
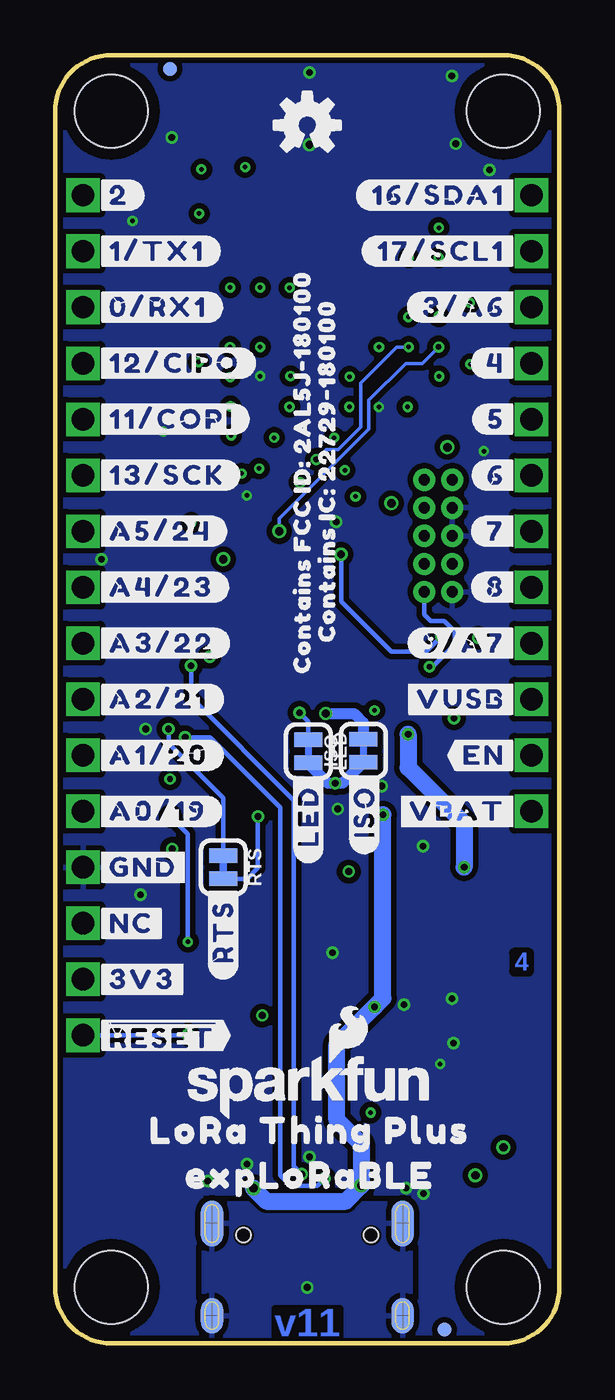
[diagram p5: board, bottom side, seen from below]

Size 22.86 x 58.42 mm. Coordinates in mm from the lower left corner, seen from the top.
Outline: 0,55.88 0,2.54 arc90 2.54,0 20.32,0 arc90 22.86,2.54 22.86,55.88 arc90 20.32,58.42 2.54,58.42 arc90 0,55.88
Copper layers (1+2*15+16): Top 0.035559375mm / dielectric 0.2mm / Route2 0.035559375mm / dielectric 1mm / Route15 0.035559375mm / dielectric 0.2mm / Bottom 0.035559375mm
Design rules "SparkFun-4-layer-FAB-LIMIT *": minimum track width 6mil, minimum drill 8mil, track to track 6mil, track to pad 6mil, pad to pad 6mil, via to via 6mil, smd to smd 6mil, copper to edge 5mil, drill to drill 5mil, minimum pad ring 5mil, minimum via ring 5mil, stop-mask expansion 4mil, vias tented up to drill 25mil, thermal gap 10mil

### Footprints (pad centres in the part's own frame; a part is rotated, then mirrored left to right if it is on the bottom)
0603 = smd 1.1 x 1: 1 -0.85,0; 2 0.85,0
LED-0603 = smd 1 x 1: A -0.877,0; C 0.877,0
SOD-323 = smd 0.63 x 0.83: A 1.15,0; C -1.15,0
FIDUCIAL-MICRO = smd 0.635 x 0.635: 1 0,0
STAND-OFF = hole 3.302: 0,0
SMT-JUMPER_2_NC_TRACE_SILK = smd 0.66 x 1.27: 1 -0.521,0; 2 0.521,0
JST-2-SMD = smd 1 x 4.6: 1 -1,-3.7; 2 1,-3.7 | smd 1.6 x 3.4: NC1 -3.4,1.5; NC2 3.4,1.5
2X5-PTH-1.27MM-NO_SILK = drill 0.508 pad 1: 1 -2.54,-0.635; 2 -2.54,0.635; 3 -1.27,-0.635; 4 -1.27,0.635; 5 0,-0.635; 6 0,0.635; 7 1.27,-0.635; 8 1.27,0.635; 9 2.54,-0.635; 10 2.54,0.635
1X12_SM_SQ_NOSILK = drill 1.016 pad 1.27 square: 1 0,0; 2 2.54,0; 3 5.08,0; 4 7.62,0; 5 10.16,0; 6 12.7,0; 7 15.24,0; 8 17.78,0; 9 20.32,0; 10 22.86,0; 11 25.4,0; 12 27.94,0
1X16_SM_SQ_NOSILK = drill 1.016 pad 1.27 square: 1 0,0; 2 2.54,0; 3 5.08,0; 4 7.62,0; 5 10.16,0; 6 12.7,0; 7 15.24,0; 8 17.78,0; 9 20.32,0; 10 22.86,0; 11 25.4,0; 12 27.94,0; 13 30.48,0; 14 33.02,0; 15 35.56,0; 16 38.1,0
USB-C-16P-4LAYER-ISOLATED = smd 0.3 x 1: A5 -1.25,-0.34; A6 -0.25,-0.34; A7 0.25,-0.34; A8 1.25,-0.34; B5 1.75,-0.34; B6 0.75,-0.34; B7 -0.75,-0.34; B8 -1.75,-0.34 | smd 0.6 x 1: GND -3.225,-0.34; GND2 3.225,-0.34; VBUS1 -2.45,-0.34; VBUS2 2.45,-0.34 | smd 1 x 2.1: SHLD1 -4.32,-0.915; SHLD2 4.32,-0.915 | smd 1 x 2.1 bottom: SHLD3 -4.32,-0.915; SHLD4 4.32,-0.915 | smd 1 x 1.6: SHLD5 -4.32,-5.095; SHLD8 4.32,-5.095 | smd 1 x 1.6 bottom: SHLD6 -4.32,-5.095; SHLD7 4.32,-5.095 | hole 0.65: -2.89,-1.445; 2.89,-1.445
JST04_1MM_RA = smd 0.6 x 1.35: 1 -1.5,0; 2 -0.5,0; 3 0.5,0; 4 1.5,0 | smd 1.2 x 2: NC1 2.8,-3.675; NC2 -2.8,-3.675
U.FL = smd 2.2 x 0.85: 1 0,1.375; 2 0,-1.375 | smd 1.05 x 1: FEED 1.525,0; NC -1.525,0
TACTILE_SWITCH_SMD_4.6X2.8MM = smd 0.9 x 1: 1 -2.05,-0.8; 2 2.05,-0.8; 3 2.05,0.8; 4 -2.05,0.8
TP_15TH = drill 0.381 pad 0.61: P$1 0,0
SOT23-5 = smd 0.55 x 1.2: 1 -0.95,-1.3; 2 0,-1.3; 3 0.95,-1.3; 4 0.95,1.3; 5 -0.95,1.3
LGA81 = smd 0.7 x 0.7: A1 -5.4,5.4; A2 -4.05,5.4; A3 -2.7,5.4; A4 -1.35,5.4; A5 0,5.4; A6 1.35,5.4; A7 2.7,5.4; A8 4.05,5.4; A9 5.4,5.4; B1 -5.4,4.05; B2 -4.05,4.05; B3 -2.7,4.05; B4 -1.35,4.05; B5 0,4.05; B6 1.35,4.05; B7 2.7,4.05; B8 4.05,4.05; B9 5.4,4.05; C1 -5.4,2.7; C2 -4.05,2.7; C3 -2.7,2.7; C4 -1.35,2.7; C5 0,2.7; C6 1.35,2.7; C7 2.7,2.7; C8 4.05,2.7; C9 5.4,2.7; D1 -5.4,1.35; D2 -4.05,1.35; D3 -2.7,1.35; D4 -1.35,1.35; D5 0,1.35; D6 1.35,1.35; D7 2.7,1.35; D8 4.05,1.35; D9 5.4,1.35; E1 -5.4,0; E2 -4.05,0; E3 -2.7,0; E4 -1.35,0; E5 0,0; E6 1.35,0; E7 2.7,0; E8 4.05,0; E9 5.4,0; F1 -5.4,-1.35; F2 -4.05,-1.35; F3 -2.7,-1.35; F4 -1.35,-1.35; F5 0,-1.35; F6 1.35,-1.35; F7 2.7,-1.35; F8 4.05,-1.35; F9 5.4,-1.35; G1 -5.4,-2.7; G2 -4.05,-2.7; G3 -2.7,-2.7; G4 -1.35,-2.7; G5 0,-2.7; G6 1.35,-2.7; G7 2.7,-2.7; G8 4.05,-2.7; G9 5.4,-2.7; H1 -5.4,-4.05; H2 -4.05,-4.05; H3 -2.7,-4.05; H4 -1.35,-4.05; H5 0,-4.05; H6 1.35,-4.05; H7 2.7,-4.05; H8 4.05,-4.05; H9 5.4,-4.05; J1 -5.4,-5.4; J2 -4.05,-5.4; J3 -2.7,-5.4; J4 -1.35,-5.4; J5 0,-5.4; J6 1.35,-5.4; J7 2.7,-5.4; J8 4.05,-5.4; J9 5.4,-5.4
MSOP10 = smd 1 x 0.3: 1 -2.25,1; 2 -2.25,0.5; 3 -2.25,0; 4 -2.25,-0.5; 5 -2.25,-1; 6 2.25,-1; 7 2.25,-0.5; 8 2.25,0; 9 2.25,0.5; 10 2.25,1
RF_4060A1_TDK = smd 0.356 x 0.737: 1 -0.65,-0.787; 2 0,-0.787; 3 0.65,-0.787; 4 0.65,0.787; 5 0,0.787; 6 -0.65,0.787
CRYSTAL-SMD-3.2X1.5MM = smd 1 x 1.8: P$1 -1.25,0; P$2 1.25,0

### Placement (x,y rotation side)
C1  15.63,23.89 0 top
C2  4.97,26.28 90 top
C3  6.86,30.61 90 top
C4  15.34,19.84 0 top
C5  13.81,27.47 0 top
C6  18.17,50.87 270 top
C7  18.18,43.65 90 top
C8  15.54,38.77 270 top
C9  18.03,39.68 0 top
C10  18.03,38.17 0 top
C11  19.22,35.82 90 top
C12  17.7,35.82 90 top
C13  15.63,25.59 0 top
C15  16,17.08 180 top
C16  7.84,56.91 0 top
C17  7.84,55.42 0 top
D1  9.91,33.91 270 top
D2  12.47,18.12 180 top
D3  12.45,16.54 180 top
D4  11.43,33.91 90 top
D5  14.4,33.91 90 top
D6  12.95,33.91 90 top
D7  8.38,33.91 90 top
FD1  17.65,57.78 0 bottom
FD2  17.65,57.78 0 top
FD3  5.21,0.64 0 bottom
FD4  5.21,0.64 0 top
FRAME1  -12.7,-20.32 0 top  (outside the outline)
FRAME2  -12.7,-20.32 0 top  (outside the outline)
H1  2.54,55.88 0 top
H2  20.32,55.88 0 top
H3  20.32,2.54 0 top
H4  2.54,2.54 0 top
ISO  8.89,26.87 90 bottom
J1  3.48,17.78 90 top
J2  5.5,36.62 270 top
J3  1.27,24.13 90 top
J4  21.59,13.97 90 top
J5  11.43,6.35 0 top
J6  5.08,9.4 270 top
J8  15.28,56.1 180 top
LED  11.38,26.85 270 bottom
LOGO1  11.43,55.24 0 bottom
LOGO2  6.86,9.53 90 top
LOGO3  17.27,10.1 0 bottom
LOGO4  -33.02,-21.59 0 top  (outside the outline)
R1  9.91,30.61 90 top
R2  8.13,22.61 0 top
R3  15.35,21.41 180 top
R4  11.43,30.61 270 top
R5  13.46,10.41 270 top
R6  11.91,10.39 270 top
R7  14.48,30.61 270 top
R8  12.95,30.61 270 top
R10  18.83,24.71 90 top
R11  16,15.56 180 top
R12  8.38,30.61 270 top
RTS  15.24,21.59 270 bottom
S1  16,10.41 270 top
S2  9.35,10.44 270 top
TP1  5.08,40.64 0 top
TP2  12.7,36.83 0 top
TP3  15.24,35.56 0 top
TP4  3.81,7.62 0 top
TP5  2.54,8.89 0 top
TP6  7.62,38.1 0 top
U1  8,25.27 180 top
U2  12.04,23.95 0 top
U3  10.2,47.21 0 top
U4  17.02,31.32 90 top
U6  11.34,56.08 90 top
U$1  [#16#SDA1#0]  1.75,52.07 0 bottom
U$2  [LORA_THING_PLUS0]  11.3,9.65 0 bottom
U$3  [EXPLORABLE0]  11.3,7.62 0 bottom
U$4  [#17#SCL1#0]  1.75,49.53 0 bottom
U$5  [#3#A6#0]  1.75,46.99 0 bottom
U$6  [#4#0]  1.75,44.45 0 bottom
U$7  [#5#0]  1.75,41.91 0 bottom
U$8  [#6#0]  1.75,39.37 0 bottom
U$9  [#7#0]  1.75,36.83 0 bottom
U$10  [#8#0]  1.75,34.29 0 bottom
U$11  [#9#A7#0]  1.75,31.75 0 bottom
U$12  [#VUSB#0]  1.75,29.21 0 bottom
U$13  [VUSB0]  4.22,29.16 0 top
U$14  [#EN#0]  1.75,26.67 0 bottom
U$15  [#VBAT#0]  1.75,24.13 0 bottom
U$16  [#2#0]  21.11,52.07 0 bottom
U$17  [#1#TX1#0]  21.11,49.53 0 bottom
U$18  [#0#RX1#0]  21.11,46.99 0 bottom
U$19  [#12#CIPO#0]  21.11,44.45 0 bottom
U$20  [#11#COPI#0]  21.11,41.91 0 bottom
U$21  [#13#SCK#0]  21.11,39.37 0 bottom
U$22  [CONTAINS_FCC_ID#_2AL5J#1801000]  11.66,39.52 90 bottom
U$23  [CONTAINS_IC#_22729#1801000]  10.54,39.57 90 bottom
U$24  [#RTS#0]  15.24,20.83 90 bottom
U$28  [#GND#0]  21.11,21.59 0 bottom
U$29  [#NC#0]  21.11,19.05 0 bottom
U$30  [#3V3#0]  21.11,16.51 0 bottom
U$31  [##RESET##0]  21.11,13.97 0 bottom
U$32  [#LED#0]  11.38,26.01 90 bottom
U$33  [#A0#19#0]  21.11,24.13 0 bottom
U$34  [#ISO#0]  8.84,26.04 90 bottom
U$35  [#A1#20#0]  21.11,26.67 0 bottom
U$36  [#A2#21#0]  21.11,29.21 0 bottom
U$37  [#A3#22#0]  21.11,31.75 0 bottom
U$38  [#A4#23#0]  21.11,34.29 0 bottom
U$39  [#A5#24#0]  21.11,36.83 0 bottom
U$62  [180]  8.38,36.83 90 top
U$64  [FOUR_LAYER_WARNING]  -1.09,66.7 0 top  (outside the outline)
U$65  [SFE_LOGO_FLAME_.2]  18.35,4.36 0 top
U$66  [160]  2.74,52.12 90 top
U$67  [CHG0]  9.91,37.59 90 top
U$68  [PWR0]  11.43,37.72 90 top
U$69  [170]  2.74,49.58 90 top
U$70  [30]  2.74,47.04 90 top
U$71  [40]  2.74,44.5 90 top
U$72  [50]  2.74,41.96 90 top
U$73  [60]  2.74,39.42 90 top
U$74  [70]  2.74,36.88 90 top
U$75  [80]  2.74,34.34 90 top
U$76  [90]  2.74,31.8 90 top
U$78  [EN0]  3.25,26.7 0 top
U$79  [VBAT0]  4.39,24.05 0 top
U$80  [20]  20.17,52.12 90 top
U$81  [10]  20.17,49.58 90 top
U$82  [00]  20.17,47.04 90 top
U$83  [120]  20.17,44.5 90 top
U$84  [110]  20.17,41.96 90 top
U$85  [130]  20.17,39.42 90 top
U$86  [A50]  20.27,36.88 90 top
U$87  [A40]  20.29,34.34 90 top
U$88  [A30]  20.17,31.8 90 top
U$89  [A20]  20.17,29.26 90 top
U$90  [A10]  20.17,26.72 90 top
U$91  [A00]  20.17,24.18 90 top
U$92  [GND0]  19.18,21.56 0 top
U$93  [NC0]  19.71,19.05 0 top
U$94  [3V30]  19.25,16.48 0 top
U$95  [#RST#0]  19.35,13.92 0 top
U$96  [RST0]  18.19,10.41 90 top
U$97  [100]  9.35,13.69 0 top
U$98  [#0]  10.41,15.88 0 top
U$99  [#_0]  10.67,19.96 0 top
U$100  [RX0]  12.95,37.08 90 top
U$101  [TX0]  14.45,37.19 90 top
Y1  18.55,47.27 270 top

### Tracks (layer width: path | path; a pad name or v marks a point on that pad's centre or on a via)
3.3V  (via drill 0.2, 0.3)
  Top 0.152: v14.91,42.49 14.91,42.52 14.27,43.16 U3.H8 | U3.H4 8.85,43.15 v9.53,42.47 | U3.H6 v12.23,42.47 | U3.H2 6.2,43.16 v6.88,42.47
  Top 0.203: 17.52,34.78 U4.7 17.52,32.64 17.4,32.64 | U4.10 16.02,32.88 16.26,32.64 | v14.4,39.45 14.57,39.62 C8.1
  Top 0.305: v16.69,37.21 16.69,37.8 17.12,38.23 17.2,38.3
  Top 0.508: C8.1 17.11,39.62 C9.1 17.18,38.32 17.2,38.3 | C11.1 C12.1 17.52,34.78 | 17.4,32.64 16.26,32.64 15.86,32.24 v15.86,31.13 R7.2 R8.2 12.95,28.83 12.96,28.82 C5.1 | R11.2 14.16,15.56 v13.47,14.87 12.14,13.54 7.29,13.54 6.53,12.78 6.53,10.33 6.1,9.9 J6.2 | 17.12,38.23 C10.1
  Route15 0.508: v3.68,32 3.68,29.44 v4.78,28.35
  Bottom 0.508: ISO.1 9.84,25.4 v10.16,25.4 10.49,25.4 11.38,26.29 LED.2
  pour Route2 (isolate 0.254): 0,0 0,44.45 22.86,44.45 22.86,0
!RESET  (via drill 0.2, 0.25, 0.3)
  Top 0.152: U3.C1 v5.47,50.59
  Top 0.203: S1.3 S1.4 16.84,12.5 v16.84,13.99 16.84,15.55 R11.1 C15.1 16.84,17.09 v16.84,18.21 | v17.64,23.9 C1.2
  Route2 0.152: v5.47,50.59 6.92,50.59 7.42,50.09 7.42,48.54 6.34,47.46 6.34,41.92 8.26,40.01 8.26,36.09 6.24,34.08 J2.10
  Route15 0.203: v16.84,18.21 16.82,18.19 11.15,18.19 10.52,18.82 9.63,18.82 7.44,21.01 7.44,22.4 6.1,23.75 6.1,27.94 6.35,28.19 6.35,30.23 v5.89,30.68
  Bottom 0.203: v5.89,30.68 5.77,30.68 4.75,31.7 4.75,32.28 5.23,32.77 5.84,32.77 6.13,33.06 J2.10 | J4.1 16.87,13.97 v16.84,13.99 | v17.64,23.9 16.84,23.1 v16.84,18.21
!RTS  (via drill 0.3)
  Top 0.203: U4.4 17.52,28.06 v17.72,27.86
  Bottom 0.203: v17.72,27.86 17.72,27.2 15.24,24.73 RTS.1
BOOT  (via drill 0.25)
  Top 0.152: U3.J7 13.45,41.25 13.45,40.68 11.81,39.04 v11.76,39.04 | R10.2 18.79,25.6 v17.66,25.6 v17.65,25.59 C13.2
  Route15 0.152: v11.76,39.04 11.56,38.84 11.56,31.12 17.09,25.6 v17.66,25.6
BT_RF
  Top 0.356: C17.1 7,54.65 7.52,54.13 9.47,54.13 10.2,53.4 U3.A5
CC1
  Top 0.203: J5.A5 10.18,7.05 9.39,7.83 9.39,8.95 10.03,9.58 11.88,9.58 R6.2
CC2
  Top 0.203: R5.2 13.46,7.62 13.18,7.34 J5.B5
D10/SWCH  (via drill 0.2)
  Top 0.152: U3.J6 11.55,41.39 9.75,39.6 v9.73,39.6
  Top 0.203: S2.1 8.55,10.48 | 8.55,10.48 v8.56,10.46 | S2.2 8.55,10.48
  Route2 0.152: v9.73,39.6 11.2,38.12 11.2,31.45 12.8,29.84 12.8,19.17 11.51,17.88 11.51,13.41 v8.56,10.46
D14/QWIIC_SDA  (via drill 0.2)
  Top 0.152: U3.G1 4.69,44.4 v4.04,44.4 | TP5.P$1
  Top 0.203: TP5.P$1 J6.3
  Route2 0.203: v4.04,44.4 3.35,43.71 3.35,41.3 2.79,40.74 2.79,9.14 TP5.P$1
D+1  (via drill 0.3)
  Top 0.203: U4.1 16.02,30.05 v16.7,30.73 | J5.A6 11.18,7.42 11.43,7.67 v11.68,7.67 11.91,7.67 12.18,7.4 J5.B6
  Bottom 0.203: v11.68,7.67 12.04,8.03 12.04,24.62 16.7,29.29 v16.7,30.73
D-1  (via drill 0.3)
  Top 0.203: J5.A7 11.68,5.38 11.48,5.18 10.9,5.18 10.68,5.4 J5.B7 10.68,7.43 v10.64,7.47 | v16.97,27.48 16.52,27.93 U4.2
  Bottom 0.203: v16.97,27.48 15.82,27.48 12.65,24.31 12.65,7.62 12.17,7.14 10.97,7.14 v10.64,7.47
EN  (via drill 0.3)
  Top 0.203: v17.55,22.42 v17.54,22.42 16.29,22.42 | R3.1 16.2,22.33 16.29,22.42 | 16.29,22.42 15.24,22.42 13.23,22.42 U2.3 | J3.2 2.62,25.32 2.62,24.31 3.56,23.37 4.22,23.37 6.18,21.4 v9.55,21.4
  Route15 0.203: v9.55,21.4 16.47,21.4 17.5,22.42 v17.55,22.42
GND  (via drill 0.2, 0.2 pad 0.1, 0.3, 0.35)
  Top 0.203: 18.76,30.32 18.8,30.35 | U4.3 17.02,30
  Top 0.597: J5.GND 8.21,7.04 8.13,7.11 | J5.GND2 14.65,7.04 14.73,7.11
  other vias: 6.18,22.54 18.99,20.35 10.05,24.23 10.12,37.26 8.05,25.27 6.96,7.05 14.16,8.13 6.16,6.79 15.94,7.37 4.8,13.61 4.86,15.63 10.29,17.72 7.05,15.37 18.76,27.86 20.76,35.56 17.96,41.35 3.43,40.46 14.17,38.46 5.41,12.67 19.35,50.9 17.58,54.69 4.88,57.48 4.7,54.41 11.33,54.36 11.33,57.63 3.17,53.21 11.33,8.46 8.18,42.47 13.56,43.86
  pour Top (isolate 0.254, rank 2): 0,0 0,58.42 22.86,58.42 22.86,0
  pour Bottom (isolate 0.254, rank 2): 0,0 0,58.42 22.86,58.42 22.86,0
  pour Route15 (isolate 0.254): 0,58.42 22.86,58.42 22.86,0 0,0
  pour Top (isolate 0.178): 3.71,53.7 16.69,53.7 16.69,40.72 3.71,40.72
  pour Route2 (isolate 0.305): 0,58.42 22.86,58.42 22.86,50.8 0,50.8
LORA_RF
  Top 0.356: C16.1 6.06,56.91 5.51,56.36 5.51,54.59 U3.A3
N$1
  Top 0.203: U1.5 8.95,22.63 R2.2
N$2
  Top 0.152: Y1.P$2 18.38,45.86 18.16,45.86 18.18,45.83
  Top 0.203: U3.F9 18.16,45.86 | C7.2 18.18,45.83
N$3
  Top 0.203: D1.C R1.2
N$4
  Top 0.203: U1.1 8.95,27.73 9.91,28.69 R1.1
N$5
  Top 0.203: D5.A 14.4,31.53 R7.1
N$6  (via drill 0.3)
  Top 0.203: v11.79,28.6 11.43,28.96 R4.2
  Bottom 0.203: LED.1 11.38,28.19 v11.79,28.6
N$7
  Top 0.203: D7.A R12.1
N$8
  Top 0.152: 18.34,48.52 Y1.P$1 | C6.2 18.34,49.86
  Top 0.203: U3.E9 16.91,48.52 18.34,48.52 18.34,49.86
N$9
  Top 0.203: D6.A R8.1
N$10
  Top 0.203: D4.A R4.1
N$11
  Top 0.203: 10.54,55.42 U6.6
  Top 0.356: C17.2 10.54,55.42
N$12
  Top 0.203: 13.74,56.08 J8.FEED
  Top 0.356: U6.2 13.74,56.08
N$13
  Top 0.356: U6.4 8.87,56.73 C16.2
N$14  (via drill 0.35)
  Top 0.508: v10.59,28.56 11.09,28.06 U2.5
  Bottom 0.508: v10.59,28.56 9.31,28.56 8.89,28.14 ISO.2
N$15  (via drill 0.3)
  Top 0.203: v13.67,23.9 C1.1 C13.1
  Bottom 0.203: RTS.2 14.16,21.07 13.67,21.56 v13.67,23.9
RXI-0  (via drill 0.25)
  Top 0.152: U3.G2 v5.48,45.18
  Top 0.203: 13.23,36.3 15.77,36.3 16.87,35.2 16.87,34.39 17.02,34.24 U4.8 | 13.23,36.3 TP2.P$1 | 13.23,36.3 12.95,36.02 D6.C
  Bottom 0.152: v5.48,45.18 6.22,44.44 6.98,44.44 8.65,42.77 8.65,41.45 10.87,39.24 10.88,39.24 12.7,37.41 TP2.P$1
SHLD  (via drill 0.3)
  other vias: 11.43,2.54
  pour Bottom: 16.13,0 6.73,0 6.73,6.35 16.13,6.35
  pour Top: 16.13,0 6.73,0 6.73,6.35 16.13,6.35
SWDCK  (via drill 0.2 pad 0.4)
  Top 0.152: U3.C2 v6.83,49.23
  Top 0.203: J2.4 6.34,38.1 TP6.P$1
  Route2 0.152: v6.83,49.23 6.83,48.72 6,47.88 6,41.81 7.67,40.13 7.67,38.15 TP6.P$1
SWDIO  (via drill 0.2)
  Top 0.152: U3.G5 9.52,43.83 v9.51,43.83 | 6.11,39.19 J2.2
  Top 0.203: TP1.P$1 6.11,39.61 6.11,39.19
  Route15 0.152: v9.51,43.83 8.94,43.26 8.94,41.96 J2.2
TXO-0  (via drill 0.2)
  Top 0.152: v12.93,41.07 10.97,39.12 9.53,39.12 7.5,41.14 U3.J3
  Top 0.203: U4.9 16.52,34.3 15.26,35.56 TP3.P$1 14.53,35.56 14.4,35.43 D5.C
  Route2 0.152: v12.93,41.07 12.93,37.72 15.09,35.56 TP3.P$1
V_BATT  (via drill 0.3)
  Top 0.762: U1.3 7.05,27.43 v6.86,27.62 C3.1 | D2.A 10.66,18.78 J1.2 4.84,18.78 4.32,19.3 v4.32,21.59 4.32,22.29 3.92,22.68 1.42,22.68 1.27,22.84 J3.1
  Bottom 0.762: v6.86,27.62 6.86,26.11 4.32,23.57 v4.32,21.59
V_USB  (via drill 0.3, 0.35, 0.38)
  Top 0.152: D1.A v9.91,35.79 v9.9,35.8 v9.9,35.79 | v5.35,32.05 3.43,30.12 3.43,29.4 2.89,28.86
  Top 0.203: 2.89,28.86 2.86,28.83
  Top 0.508: 5,24.04 4.97,24.08 C2.1 | 13.88,7.02 v13.87,7.04
  Top 0.597: J5.VBUS2 13.88,7.02 | v8.97,7.16 8.98,7.15 J5.VBUS1
  Top 0.762: J3.3 2.48,29.21 2.86,28.83 3.43,28.26 3.43,26.8 | 7.05,24.04 6.18,24.04 | 7.05,24.04 U1.4 | v8,23.97 7.93,24.04 7.05,24.04 | D3.A 11.3,15.8 10.75,15.26 v8.39,15.26
  Top 0.813: 6.18,24.04 5,24.04 4.01,24.04 3.43,24.62 3.43,26.8
  Bottom 0.203: v5.35,32.05 6.04,31.37 7.62,31.37 9.9,33.65 v9.9,35.79
  Bottom 0.762: v8,23.97 8,15.65 v8.39,15.26 10.08,13.56 10.08,10.13 8.99,9.04 8.99,7.18 v8.97,7.16 9.69,6.45 13.28,6.45 v13.87,7.04
VIN
  Top 0.508: U2.1 11.12,22.62 11.12,21.77
  Top 0.762: D3.C 13.62,16.56 D2.C 13.62,18.48 12.13,19.98 12.13,21.4 | 12.13,21.4 11.49,21.4 11.12,21.77 | C4.1 14.5,19.85 R3.2 12.14,21.41 12.13,21.4
~D0/RXI-1  (via drill 0.2)
  Top 0.152: U3.D8 v14.93,47.88
  Route15 0.152: v14.93,47.88 20.7,47.88 J4.14
~D1/TXO-1  (via drill 0.2)
  Top 0.152: U3.A9 v16.23,53.24
  Route15 0.152: v16.23,53.24 17.88,53.24 J4.15
~D2  (via drill 0.2)
  Top 0.152: U3.A8 v14.25,53.34
  Route15 0.152: v14.25,53.34 14.66,53.75 18.31,53.75 19.99,52.07 J4.16
~D3/A6  (via drill 0.2)
  Top 0.152: U3.E7 v12.23,47.87
  Route15 0.152: J3.10 2.79,48.51 11.59,48.51 v12.23,47.87
~D4  (via drill 0.2)
  Top 0.152: U3.E1 4.78,47.19 v4.06,47.19
  Route2 0.152: v4.06,47.19 1.32,44.45 J3.9
~D5  (via drill 0.2)
  Top 0.152: v5.47,49.24 v5.47,49.23 U3.D2
  Route2 0.152: v5.47,49.24 5.46,49.23 5.46,47.88 2.52,44.93 2.52,43.16 J3.8
~D6  (via drill 0.2)
  Top 0.152: U3.F2 5.47,46.53 v5.47,46.57
  Route2 0.152: v5.47,46.57 5.17,46.57 2.92,44.32 2.92,41.81 2.23,41.12 2.23,40.34 J3.7
~D7  (via drill 0.2)
  Top 0.152: v6.84,46.55 U3.E3
  Route15 0.152: J3.6 1.98,36.83 2.52,37.36 2.52,46.97 3.43,47.88 5.51,47.88 v6.84,46.55
~D8  (via drill 0.2)
  Top 0.152: U3.G4 8.19,43.85 v5.45,43.85
  Route15 0.152: v5.45,43.85 3.16,43.85 2.85,43.54 2.85,35.2 1.93,34.29 J3.5
~D9/A7  (via drill 0.2)
  Top 0.152: U3.F8 14.92,45.19 v14.94,45.19 | v13.61,39.67 12.34,38.41 v9.25,38.41
  Route2 0.152: v14.94,45.19 14.36,44.61 14.36,40.42 v13.61,39.67
  Route15 0.152: J3.4 1.29,31.75 2.79,33.25 6.81,33.25 7.44,33.88 7.44,36.75 | v9.25,38.41 9.09,38.41 7.44,36.75 | J2.6 6.26,36.75 7.44,36.75
~D11/MOSI
  Top 0.152: U3.H9 16.34,42.42 16.74,42.42 17.25,41.91 J4.12
~D12/MISO  (via drill 0.2)
  Top 0.152: U3.G3 8.2,45.21 8.2,45.2 v8.18,45.18
  Route15 0.152: v8.18,45.18 8.28,45.18 9.5,46.41 19.63,46.41 J4.13
~D13/SCK  (via drill 0.2)
  Top 0.152: v14.88,41.17 U3.J8
  Route15 0.152: v14.88,41.17 15.37,40.69 20.27,40.69 J4.11
~D15/QWIIC_SCL  (via drill 0.2)
  Top 0.152: U3.J5 10.21,41.79 v10.21,41.07
  Top 0.203: TP4.P$1 4.09,7.9 J6.4
  Route2 0.203: v10.21,41.07 9.25,41.07 8.64,40.46 8.64,33.66 6.43,31.45 5.54,31.45 3.76,29.67 3.76,7.67 TP4.P$1
~D16/SDA1
  Top 0.152: U3.E2 5.5,47.85 3.96,47.85 2.49,49.33 2.49,50.85 J3.12
~D17/SCL1
  Top 0.152: U3.F1 4,45.86 2.39,47.47 2.39,48.41 J3.11
~D18/LED  (via drill 0.2, 0.25)
  Top 0.152: U3.F3 v6.83,45.19
  Top 0.203: v8.38,28.7 R12.2
  Route15 0.152: v11.02,40.08 11.02,31.34 v8.38,28.7
  Bottom 0.152: v11.02,40.08 10.57,40.54 10.03,40.54 9.02,41.55 9.02,43.54 7.37,45.19 v6.83,45.19
~D19/A0  (via drill 0.2)
  Top 0.152: U3.G8 14.94,43.82 14.94,43.81 v14.93,43.83
  Route2 0.152: v14.93,43.83 18.38,43.83 19,43.2 19,29.46 19.74,28.73 19.74,26.01 21.59,24.16 J4.5
~D20/A1  (via drill 0.2)
  Top 0.152: U3.G9 v16.35,44.51 v16.36,44.5
  Route2 0.152: v16.36,44.5 18.49,44.5 19.33,43.66 19.33,29.59 20.12,28.8 20.12,28.14 J4.6
~D21/A2  (via drill 0.2)
  Top 0.152: U3.G6 v12.19,43.87
  Route15 0.152: v12.19,43.87 12.21,43.87 13.45,42.62 13.45,40.7 14.22,39.93 18.34,39.93 19.76,38.51 19.76,31.04 J4.7
~D22/A3  (via drill 0.2)
  Top 0.152: U3.F7 v13.56,45.19
  Route15 0.152: v13.56,45.19 14.12,44.63 14.12,40.79 14.61,40.31 19.1,40.31 20.19,39.22 20.19,33.15 J4.8
~D23/A4  (via drill 0.2)
  Top 0.152: U3.E8 v13.56,47.88
  Route2 0.152: v13.56,47.88 | v13.56,47.88 14.91,46.53 17.65,46.53 20.02,44.17 20.02,34.77 20.5,34.29 J4.9
~D24/A5  (via drill 0.2)
  Top 0.152: U3.B9 15.62,51.23 v16.33,51.23
  Route2 0.152: v16.33,51.23 18.09,51.23 20.34,48.97 20.34,38.08 J4.10

### Text on the board
Top: 1
Route2: 2
Route15: 3
Bottom: 4 | v11
tDocu: Daniel Dobre | 4-LAYER BOARD